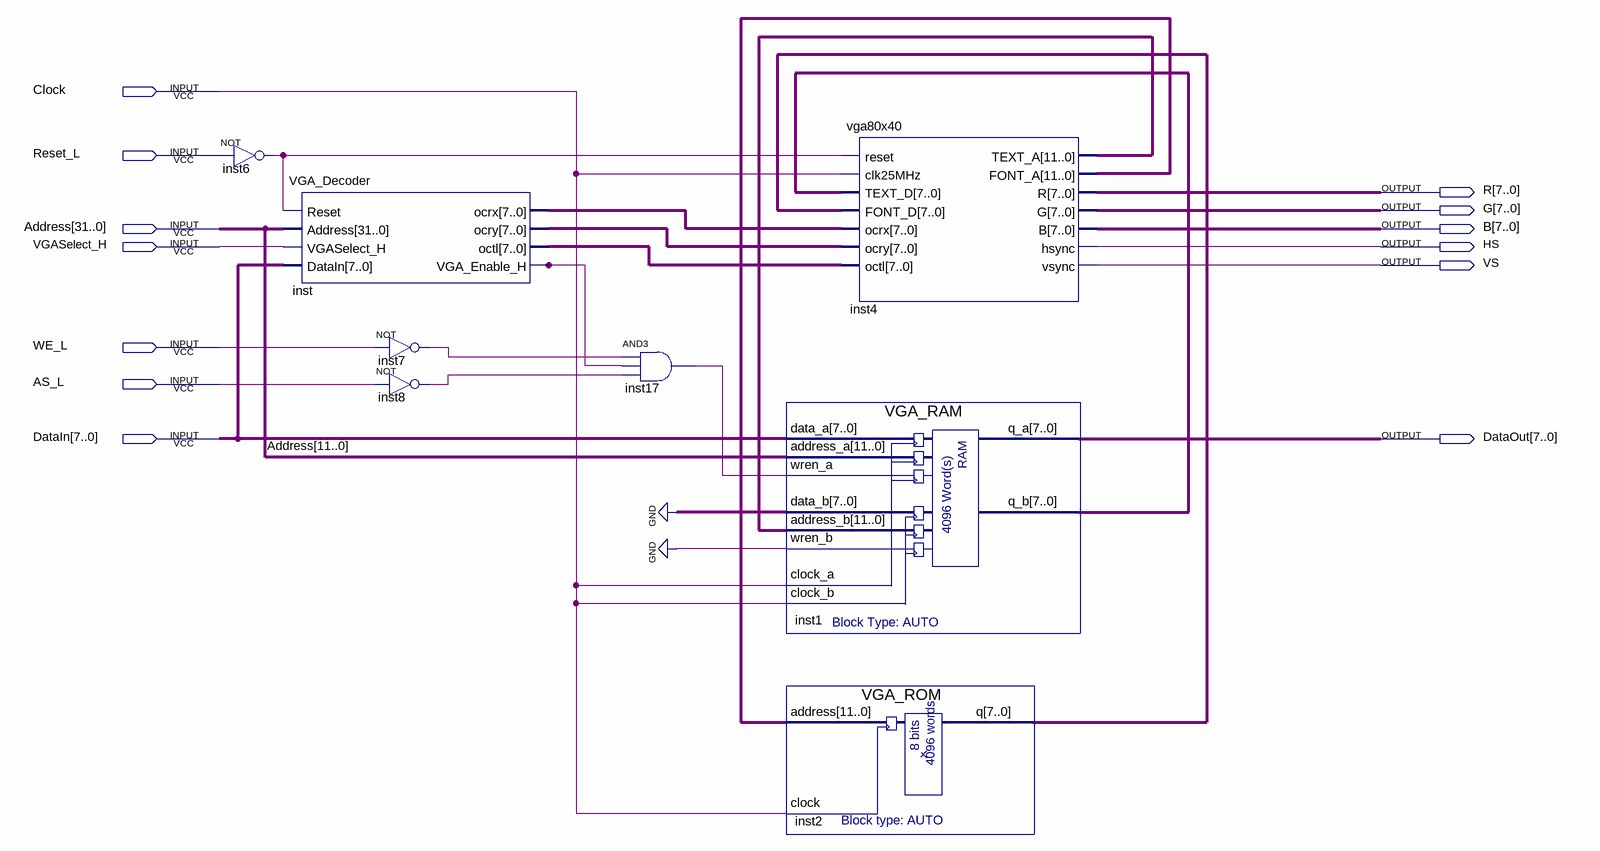
[diagram p0: schematic sheet]
// Quartus schematic VGA_Controller.bdf as structural Verilog: 8 symbols, 13 pins
module VGA_Controller (
  input  Clock,
  input  Reset_L,
  input  [31:0] Address,
  input  VGASelect_H,
  input  WE_L,
  input  AS_L,
  input  [7:0] DataIn,
  output [7:0] R,
  output [7:0] G,
  output [7:0] B,
  output HS,
  output VS,
  output [7:0] DataOut
);

  wire inst6_out, inst7_out, inst8_out, inst17_out, inst_vga_enable_h;
  wire [7:0] inst1_q_b, inst2_q, inst_ocrx, inst_ocry, inst_octl;
  wire [11:0] inst4_font_a, inst4_text_a;

  not inst6 (inst6_out, Reset_L);
  VGA_Decoder inst (
    .Reset(inst6_out), .Address(Address), .VGASelect_H(VGASelect_H), .DataIn(DataIn), .ocrx(inst_ocrx),
    .ocry(inst_ocry), .octl(inst_octl), .VGA_Enable_H(inst_vga_enable_h));
  not inst7 (inst7_out, WE_L);
  not inst8 (inst8_out, AS_L);
  and inst17 (inst17_out, inst7_out, inst_vga_enable_h, inst8_out);
  VGA_RAM inst1 (
    .data_a(DataIn), .address_a(Address[11:0]), .wren_a(inst17_out), .data_b({8{1'b0}}),
    .address_b(inst4_text_a), .wren_b(1'b0), .clock_a(Clock), .clock_b(Clock), .q_a(DataOut), .q_b(inst1_q_b));
  VGA_ROM inst2 (.address(inst4_font_a), .clock(Clock), .q(inst2_q));
  vga80x40 inst4 (
    .reset(inst6_out), .clk25MHz(Clock), .TEXT_D(inst1_q_b), .FONT_D(inst2_q), .ocrx(inst_ocrx),
    .ocry(inst_ocry), .octl(inst_octl), .TEXT_A(inst4_text_a), .FONT_A(inst4_font_a), .R(R), .G(G), .B(B),
    .hsync(HS), .vsync(VS));
endmodule
